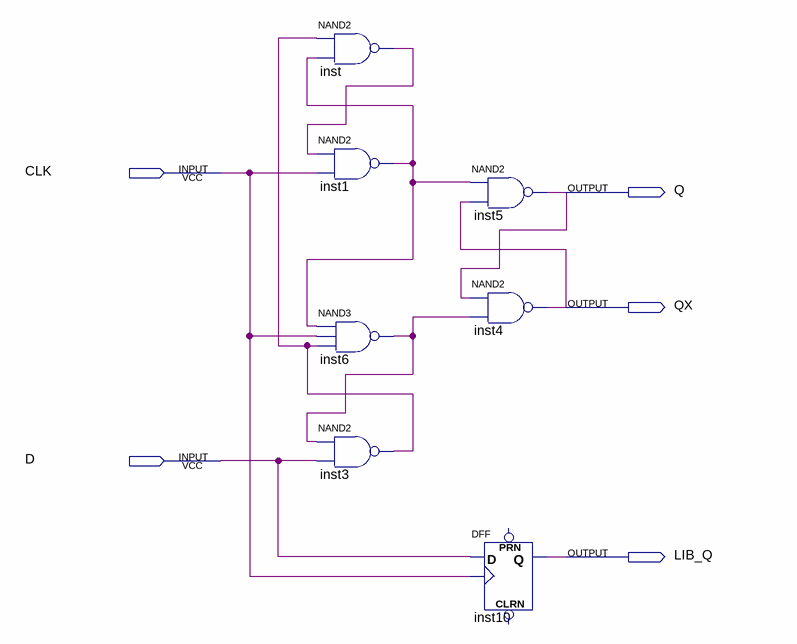
[diagram p0: schematic sheet]
// Quartus schematic DFFPOS.bdf as structural Verilog: 7 symbols, 5 pins
module DFFPOS (
  input  CLK,
  input  D,
  output Q,
  output QX,
  output LIB_Q
);

  wire inst1_out, inst3_out, inst6_out, inst_out;

  nand inst (inst_out, inst3_out, inst1_out);
  nand inst1 (inst1_out, inst_out, CLK);
  nand inst6 (inst6_out, inst1_out, CLK, inst3_out);
  nand inst3 (inst3_out, inst6_out, D);
  nand inst5 (Q, inst1_out, QX);
  nand inst4 (QX, Q, inst6_out);
  DFF inst10 (.CLK(CLK), .D(D), .Q(LIB_Q));  // open: CLRN, PRN
endmodule
